# EasyEDA Pro project Amplifier_6Channels _2024-06-29.epro

# Schematic 运放
Create Date: 2024-05-17; Page Name: P1; Project Name: 十九届折线电磁; Schematic Name: 运放; Update Date: 2024-05-27; Company: 嘉立创EDA; Page Size: A4; Version: V1.0
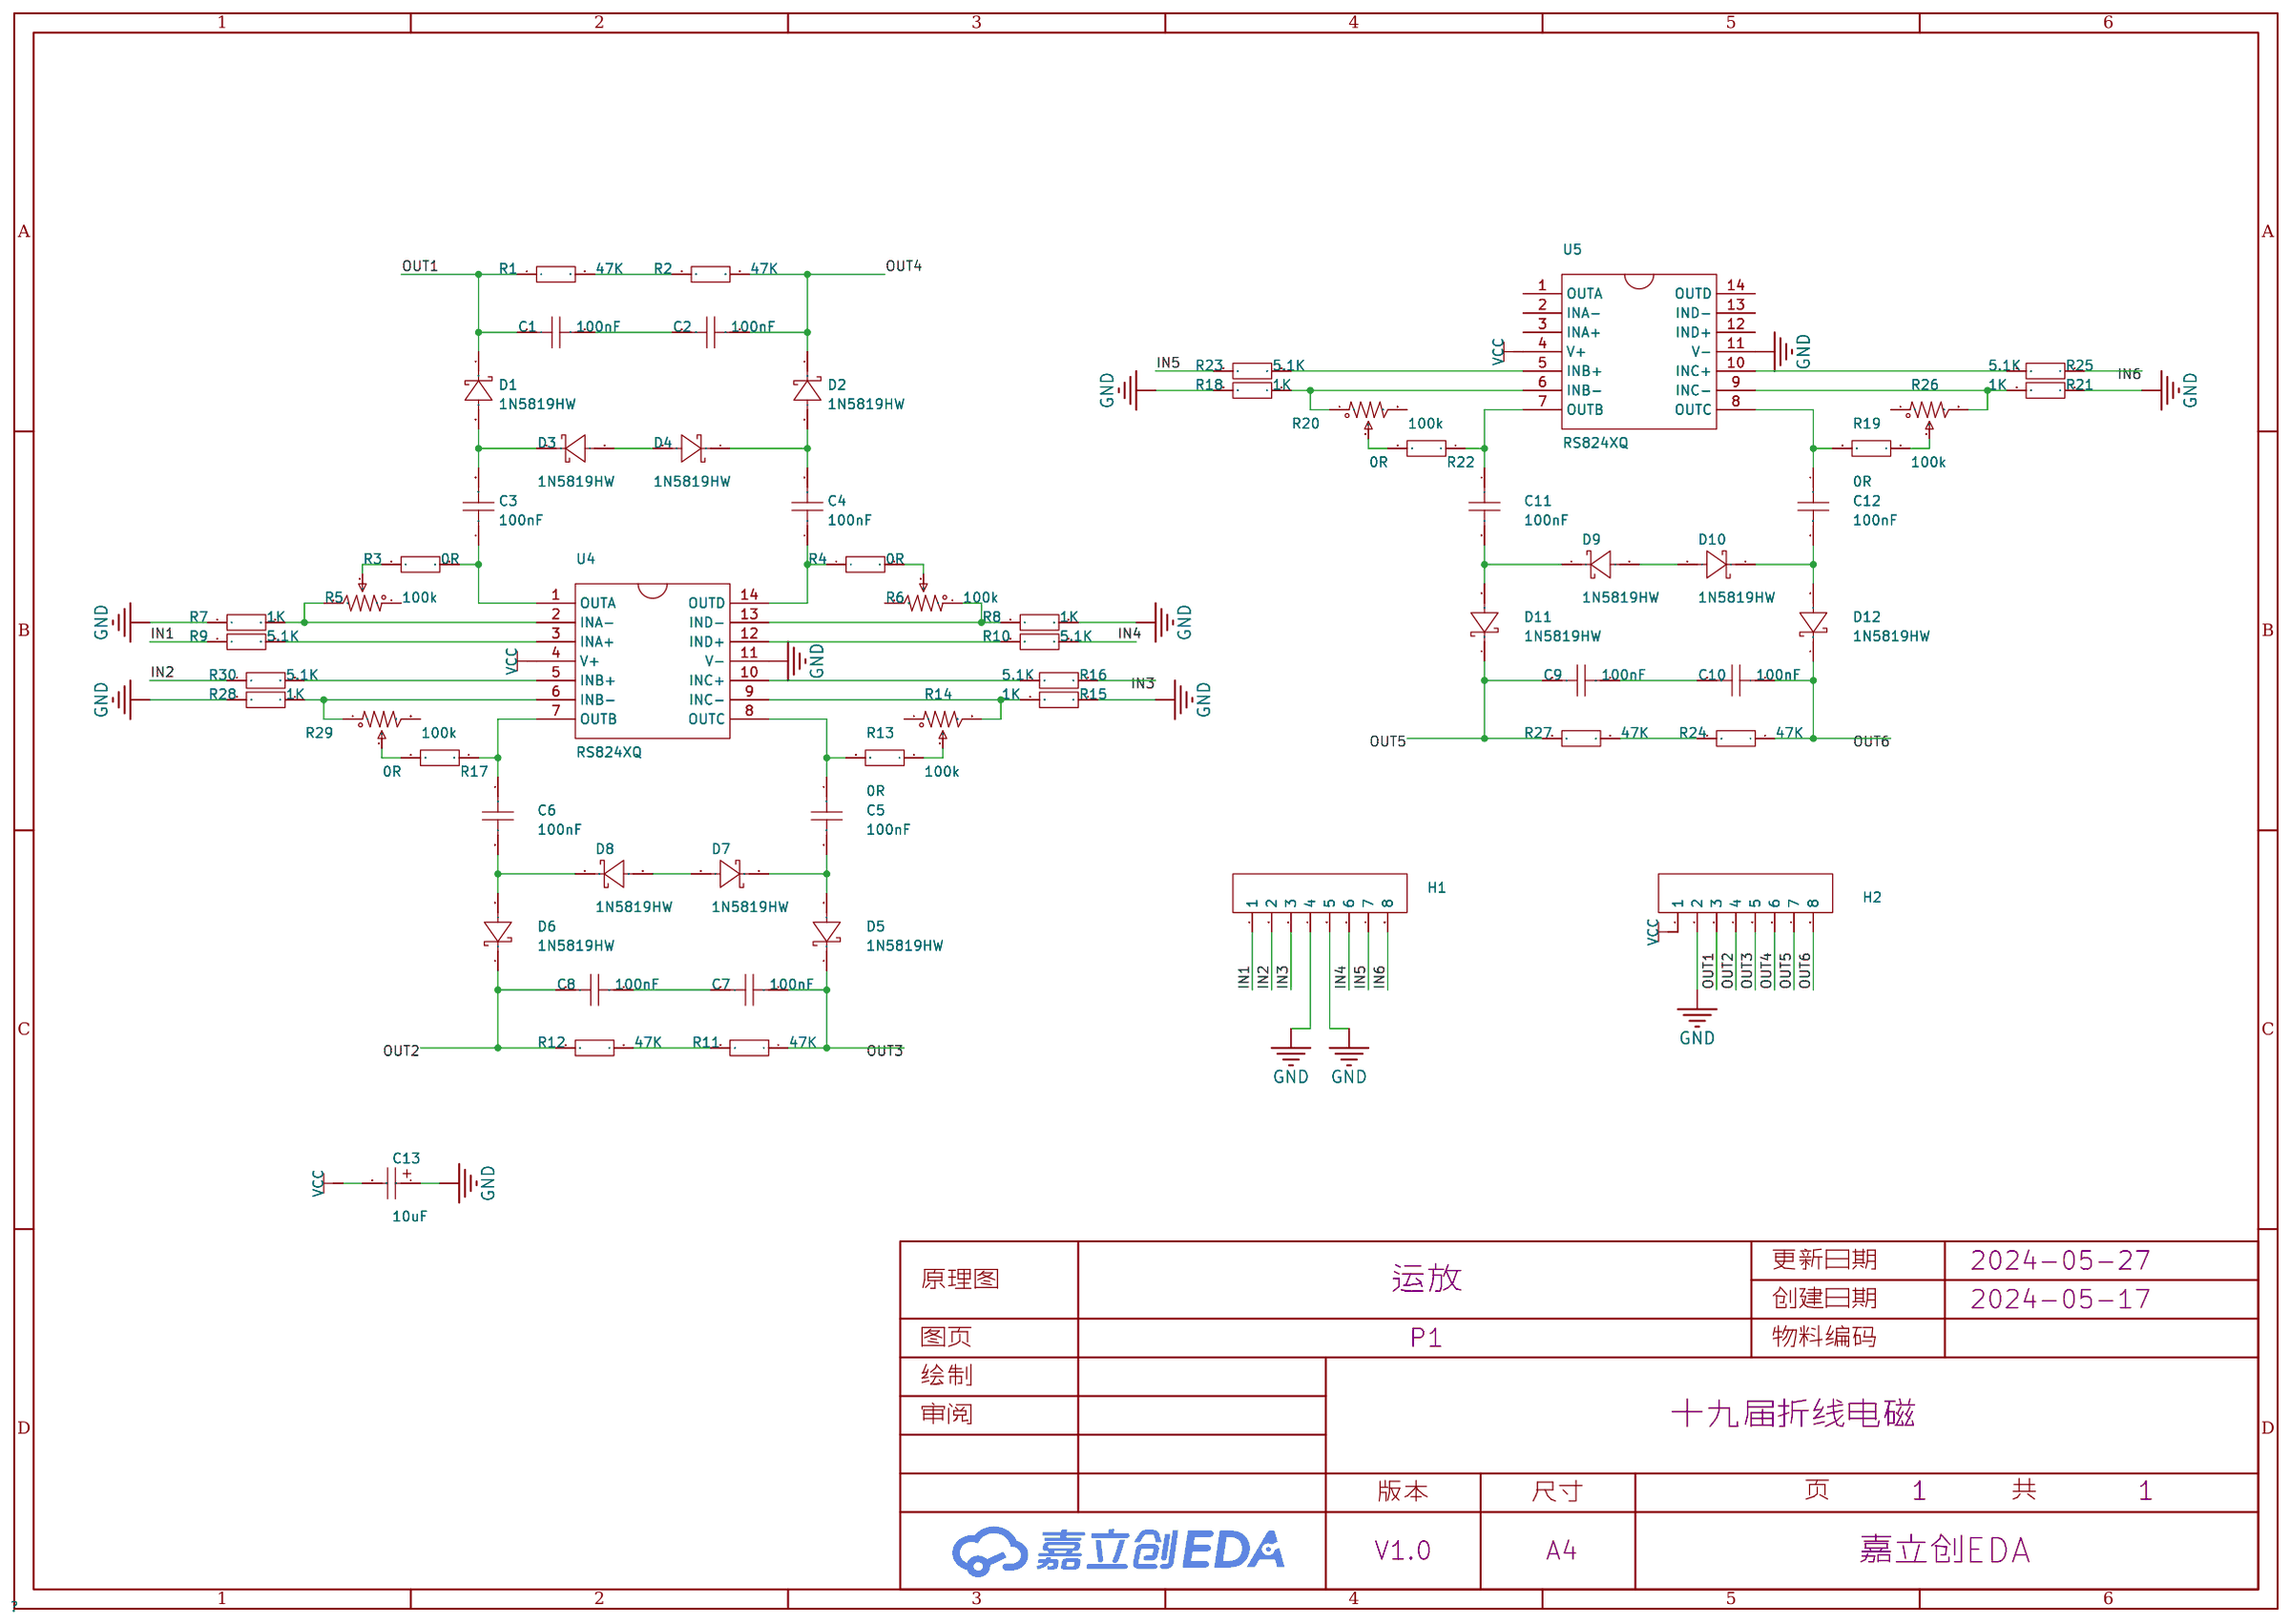
[diagram p0: schematic sheet]

## Parts
C1  100nF  [C0603]
C2  100nF  [C0603]
C3  100nF  [C0603]
C4  100nF  [C0603]
C5  100nF  [C0603]
C6  100nF  [C0603]
C7  100nF  [C0603]
C8  100nF  [C0603]
C9  100nF  [C0603]
C10  100nF  [C0603]
C11  100nF  [C0603]
C12  100nF  [C0603]
C13  10uF  [CAP-SMD_L3.2-W1.6-RD-C7171]
D1  1N5819HW  [SOD-123_L2.7-W1.6-LS3.7-RD-1]
D2  1N5819HW  [SOD-123_L2.7-W1.6-LS3.7-RD-1]
D3  1N5819HW  [SOD-123_L2.7-W1.6-LS3.7-RD-1]
D4  1N5819HW  [SOD-123_L2.7-W1.6-LS3.7-RD-1]
D5  1N5819HW  [SOD-123_L2.7-W1.6-LS3.7-RD-1]
D6  1N5819HW  [SOD-123_L2.7-W1.6-LS3.7-RD-1]
D7  1N5819HW  [SOD-123_L2.7-W1.6-LS3.7-RD-1]
D8  1N5819HW  [SOD-123_L2.7-W1.6-LS3.7-RD-1]
D9  1N5819HW  [SOD-123_L2.7-W1.6-LS3.7-RD-1]
D10  1N5819HW  [SOD-123_L2.7-W1.6-LS3.7-RD-1]
D11  1N5819HW  [SOD-123_L2.7-W1.6-LS3.7-RD-1]
D12  1N5819HW  [SOD-123_L2.7-W1.6-LS3.7-RD-1]
H1  -  [HDR-TH_8P-P2.54-V-F-1]
H2  -  [HDR-TH_8P-P2.54-V-F-1]
R1  47K  [R0603]
R2  47K  [R0603]
R3  0R  [R0603]
R4  0R  [R0603]
R5  100k  [RES-ADJ-TH_3P-L9.5-W4.85-P2.50-BL-BS]
R6  100k  [RES-ADJ-TH_3P-L9.5-W4.85-P2.50-BL-BS]
R7  1K  [R0603]
R8  1K  [R0603]
R9  5.1K  [R0603]
R10  5.1K  [R0603]
R11  47K  [R0603]
R12  47K  [R0603]
R13  0R  [R0603]
R14  100k  [RES-ADJ-TH_3P-L9.5-W4.85-P2.50-BL-BS]
R15  1K  [R0603]
R16  5.1K  [R0603]
R17  0R  [R0603]
R18  1K  [R0603]
R19  0R  [R0603]
R20  100k  [RES-ADJ-TH_3P-L9.5-W4.85-P2.50-BL-BS]
R21  1K  [R0603]
R22  0R  [R0603]
R23  5.1K  [R0603]
R24  47K  [R0603]
R25  5.1K  [R0603]
R26  100k  [RES-ADJ-TH_3P-L9.5-W4.85-P2.50-BL-BS]
R27  47K  [R0603]
R28  1K  [R0603]
R29  100k  [RES-ADJ-TH_3P-L9.5-W4.85-P2.50-BL-BS]
R30  5.1K  [R0603]
U4  RS824XQ  [TSSOP-14]
U5  RS824XQ  [TSSOP-14]

## Library data of the parts
C1-C12 = CAP_0603: Supplier Footprint: 0603
C13 = TAJA106K016RNJ: 容值:10uF;精度:±10%;额定电压:16V;等效串联电阻:3Ω@100kHz;; LCSC Part Name: 10uF ±10% 16V; Supplier Part: C7171; Manufacturer: Kyocera AVX; Supplier Footprint: CASE-A-3216; JLCPCB Part Class: 基础库; Datasheet: https://atta.szlcsc.com/upload/public/pdf/source/20160107/1457707750344.pdf; Supplier: LCSC; Tolerance: ±10%; Rated Voltage: 16V; Equivalent Series Resistance(ESR): 3Ω@100kHz; Operating Temperature: -55℃~+125℃
D1-D12 = 1N5819HW: 二极管配置:-;正向压降(Vf):900mV@3A;直流反向耐压(Vr):40V;平均整流电流(Io):1A;; LCSC Part Name: 电压:40V 电流:1A; Supplier Part: C2905649; Manufacturer: TECH PUBLIC(台舟); Supplier Footprint: SOD-123; JLCPCB Part Class: 扩展库; Datasheet: https://atta.szlcsc.com/upload/public/pdf/source/20211020/8C6B6169F42B21129AF0D528B0E96B00.pdf; Supplier: LCSC; Forward Voltage (Vf@If): 900mV@3A; Reverse Voltage (Vr): 40V; Average Rectified Current (Io): 1A; Reverse Leakage Current (Ir): 1mA@40V
H1 H2 = HDR-F_2.54_1x8P: Supplier Part: C27438; Supplier Footprint: 插件
R1-R4 R7-R13 R15-R19 R21-R25 R27 R28 R30 = Res_0603: Supplier Footprint: 0603
R5 R6 R14 R20 R26 R29 = 可调电阻: 阻值:50kΩ;精度:±10%;; LCSC Part Name: 50kΩ ±10%; Supplier Part: C118911; Manufacturer: BOCHEN(博晨); Manufacturer Part: 3296W-1-503; Supplier Footprint: 插件; JLCPCB Part Class: 扩展库; Datasheet: https://atta.szlcsc.com/upload/public/pdf/source/20171114/C118911_15106326557211117401.pdf; Supplier: LCSC; Tolerance: ±10%
U4 U5 = RS824XQ

## Nets
GND: C13.1 H1.4 H1.5 H2.2 R7.1 R8.2 R15.1 R18.2 R21.1 R28.2 U4.11(V-) U5.11(V-)
VCC: C13.2 H2.1 U4.4(V+) U5.4(V+)
IN1: H1.1 R9.1
IN2: H1.2 R30.1
IN3: H1.3 R16.1
IN4: H1.6 R10.1
IN5: H1.7 R23.1
IN6: H1.8 R25.1
OUT1: C1.1 D1.1(K) H2.3 R1.1
OUT2: C8.2 D6.1(K) H2.4 R12.2
OUT3: C7.1 D5.1(K) H2.5 R11.1
OUT4: C2.2 D2.1(K) H2.6 R2.2
OUT5: C9.2 D11.1(K) H2.7 R27.2
OUT6: C10.1 D12.1(K) H2.8 R24.1
$1N672: D3.2(A) D4.2(A)
$1N675: C3.2 D1.2(A) D3.1(K)
$1N680: C4.2 D2.2(A) D4.1(K)
$1N763: C1.2 C2.1
$1N935: C3.1 R3.2 U4.1(OUTA)
$1N1156: R3.1 R5.2
$1N1168: R5.3 R7.2 U4.2(INA-)
$1N2155: C4.1 R4.1 U4.14(OUTD)
$1N2200: R4.2 R6.2
$1N2236: R10.2 U4.12(IND+)
$1N2317: R6.1 R8.1 U4.13(IND-)
$1N4845: R1.2 R2.1
$1N4873: R9.2 U4.3(INA+)
$1N5401: D7.2(A) D8.2(A)
$1N5403: C5.2 D5.2(A) D7.1(K)
$1N5407: C6.2 D6.2(A) D8.1(K)
$1N5411: C7.2 C8.1
$1N5427: C5.1 R13.2 U4.8(OUTC)
$1N5432: R13.1 R14.2
$1N5435: R14.3 R15.2 U4.9(INC-)
$1N5448: C6.1 R17.1 U4.7(OUTB)
$1N5453: R17.2 R29.2
$1N5456: R30.2 U4.5(INB+)
$1N5458: R28.1 R29.1 U4.6(INB-)
$1N5465: R11.2 R12.1
$1N5467: R16.2 U4.10(INC+)
$1N6701: R25.2 U5.10(INC+)
$1N6702: R24.2 R27.1
$1N6704: R18.1 R20.1 U5.6(INB-)
$1N6705: R23.2 U5.5(INB+)
$1N6706: R20.2 R22.2
$1N6707: C11.1 R22.1 U5.7(OUTB)
$1N6713: R21.2 R26.3 U5.9(INC-)
$1N6714: R19.1 R26.2
$1N6715: C12.1 R19.2 U5.8(OUTC)
$1N6720: C9.1 C10.2
$1N6721: C11.2 D9.1(K) D11.2(A)
$1N6722: C12.2 D10.1(K) D12.2(A)
$1N6723: D9.2(A) D10.2(A)

Not connected (* = marked no-connect by the designer): R5 1; R6 3; R14 1; R20 3; R26 1; R29 3; U5 1(OUTA) 2(INA-) 3(INA+) 12(IND+) 13(IND-) 14(OUTD)

# Board PCB4
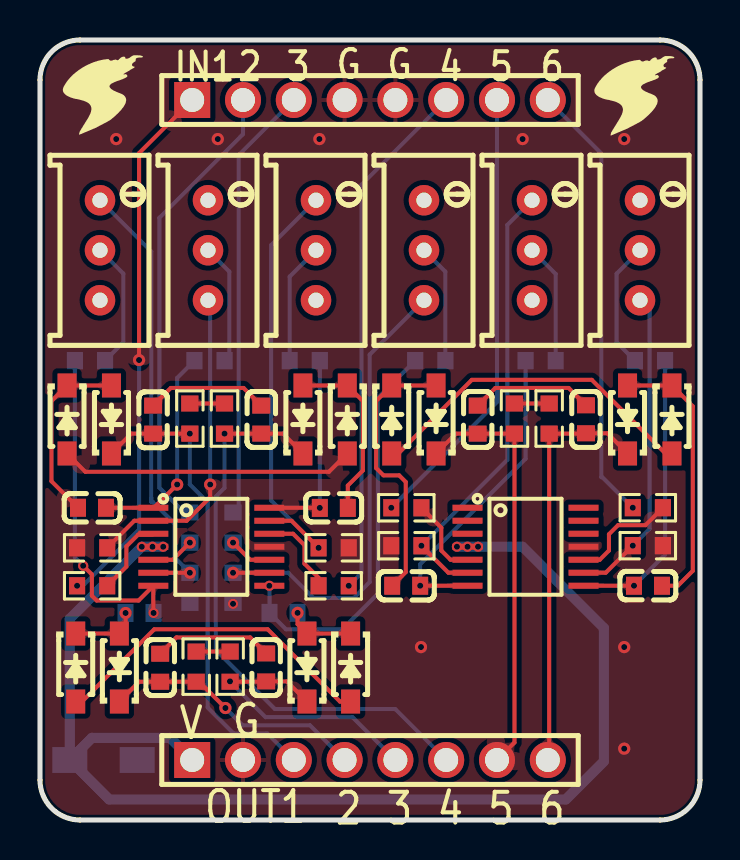
[diagram p1: board, top side]
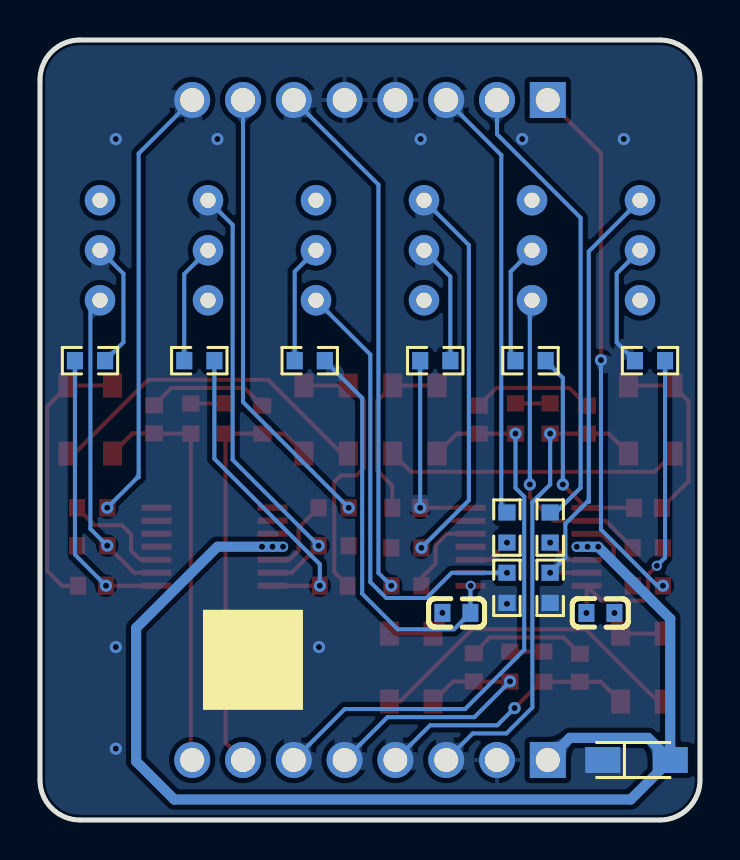
[diagram p2: board, bottom side, seen from below]

Outline 33 x 39 mm; copper layers: Top Layer, Bottom Layer. Coordinates in mm from the lower left corner of the outline.
Outline path: 0,37 0,2 arc(0.59,0.59) 2,0 31,0 arc(32.41,0.59) 33,2 33,37 arc(32.41,38.41) 31,39 2,39 arc(0.59,38.41) 0,37
Stack: Top Layer 0.035mm / Dielectric1 1.51mm FR4 er 4.5 / Bottom Layer 0.035mm

## Design rules (mm)
template: 自定义配置
spacing copperThickness1oz (default): track to track 0.203, other pairs 0.203 to 0.203
spacing copperThickness2oz: track to track 0.203, other pairs 0.152 to 0.3
track width copperThickness1oz (default): min 0.203, default 0.203, max 2.54
track width copperThickness2oz: min 0.203, default 0.254, max 2.54
track width VCC: min 0.508, default 0.508, max 2.54
differential pair differentialPair (default): width min 0.127, default 0.254, max 2.54; gap min 0.152, default 0.152
via viaSize (default): diameter min 0.5, default 0.61, max 10; hole min 0.3, default 0.305, max 6.299
net VCC uses VCC

## Placement (name value [footprint] x y rotation side)
C1  100nF  [C0603]  5.66 20.02 90 top
C2  100nF  [C0603]  11.06 20.02 270 top
C3  100nF  [C0603]  2.6 15.61 180 top
C4  100nF  [C0603]  14.69 15.61 0 top
C5  100nF  [C0603]  12.18 10.36 0 bottom
C6  100nF  [C0603]  4.98 10.35 180 bottom
C7  100nF  [C0603]  11.31 7.63 90 top
C8  100nF  [C0603]  6.01 7.61 270 top
C9  100nF  [C0603]  21.88 20.02 270 top
C10  100nF  [C0603]  27.3 20.03 90 top
C11  100nF  [C0603]  18.31 11.71 180 top
C12  100nF  [C0603]  30.4 11.71 0 top
C13  10uF  [CAP-SMD_L3.2-W1.6-RD-C7171]  3.18 3 180 bottom
D1  1N5819HW  [SOD-123_L2.7-W1.6-LS3.7-RD-1]  3.57 20.03 90 top
D2  1N5819HW  [SOD-123_L2.7-W1.6-LS3.7-RD-1]  13.14 20.03 90 top
D3  1N5819HW  [SOD-123_L2.7-W1.6-LS3.7-RD-1]  1.35 20.03 270 top
D4  1N5819HW  [SOD-123_L2.7-W1.6-LS3.7-RD-1]  15.37 20.03 270 top
D5  1N5819HW  [SOD-123_L2.7-W1.6-LS3.7-RD-1]  13.35 7.62 90 top
D6  1N5819HW  [SOD-123_L2.7-W1.6-LS3.7-RD-1]  3.97 7.62 90 top
D7  1N5819HW  [SOD-123_L2.7-W1.6-LS3.7-RD-1]  15.53 7.62 270 top
D8  1N5819HW  [SOD-123_L2.7-W1.6-LS3.7-RD-1]  1.79 7.62 270 top
D9  1N5819HW  [SOD-123_L2.7-W1.6-LS3.7-RD-1]  17.59 20.03 270 top
D10  1N5819HW  [SOD-123_L2.7-W1.6-LS3.7-RD-1]  31.6 20.03 270 top
D11  1N5819HW  [SOD-123_L2.7-W1.6-LS3.7-RD-1]  19.81 20.03 90 top
D12  1N5819HW  [SOD-123_L2.7-W1.6-LS3.7-RD-1]  29.38 20.03 90 top
H1  -  [HDR-TH_8P-P2.54-V-F-1]  16.5 36 0 top
H2  -  [HDR-TH_8P-P2.54-V-F-1]  16.5 3 0 top
R1  47K  [R0603]  7.49 20.07 90 top
R2  47K  [R0603]  9.23 20.07 270 top
R3  0R  [R0603]  8.47 22.97 180 bottom
R4  0R  [R0603]  13.24 22.97 180 bottom
R5  100k  [RES-ADJ-TH_3P-L9.5-W4.85-P2.50-BL-BS]  8.4 28.49 0 top
R6  100k  [RES-ADJ-TH_3P-L9.5-W4.85-P2.50-BL-BS]  13.8 28.49 0 top
R7  1K  [R0603]  2.61 13.61 0 top
R8  1K  [R0603]  14.68 13.61 0 top
R9  5.1K  [R0603]  2.61 11.71 0 top
R10  5.1K  [R0603]  14.68 11.71 180 top
R11  47K  [R0603]  9.51 7.67 90 top
R12  47K  [R0603]  7.81 7.67 270 top
R13  0R  [R0603]  19.51 22.97 180 bottom
R14  100k  [RES-ADJ-TH_3P-L9.5-W4.85-P2.50-BL-BS]  19.2 28.49 0 top
R15  1K  [R0603]  9.65 11.61 90 bottom
R16  5.1K  [R0603]  9.65 14.62 270 bottom
R17  0R  [R0603]  2.5 22.97 0 bottom
R18  1K  [R0603]  18.32 13.71 180 top
R19  0R  [R0603]  30.5 22.97 0 bottom
R20  100k  [RES-ADJ-TH_3P-L9.5-W4.85-P2.50-BL-BS]  24.6 28.49 0 top
R21  1K  [R0603]  30.39 13.72 180 top
R22  0R  [R0603]  25.03 22.97 0 bottom
R23  5.1K  [R0603]  18.32 15.61 0 top
R24  47K  [R0603]  25.46 20.07 90 top
R25  5.1K  [R0603]  30.39 15.61 0 top
R26  100k  [RES-ADJ-TH_3P-L9.5-W4.85-P2.50-BL-BS]  30 28.49 0 top
R27  47K  [R0603]  23.72 20.07 270 top
R28  1K  [R0603]  7.49 11.61 270 bottom
R29  100k  [RES-ADJ-TH_3P-L9.5-W4.85-P2.50-BL-BS]  3 28.49 0 top
R30  5.1K  [R0603]  7.49 14.62 270 bottom
U4  RS824XQ  [TSSOP-14]  8.57 13.66 0 top
U5  RS824XQ  [TSSOP-14]  24.28 13.66 0 top
U6  -  [JLC-QRCODE-5x5]  22.35 8.01 180 bottom

## Footprints (pads in the part's own frame, mm; a bottom-side part is the same pattern mirrored in y, then rotated)
C0603
  rect 0.8x0.9 smd: 1(-0.7,0) 2(0.7,0)
CAP-SMD_L3.2-W1.6-RD-C7171
  rect 1.758x1.296 smd: 1(-1.687,0) 2(1.687,0)
HDR-TH_8P-P2.54-V-F-1
  rect 1.8x1.8 hole 1.2: 1(-8.89,0)
  round 1.8 hole 1.2: 2(-6.35,0) 3(-3.81,0) 4(-1.27,0) 5(1.27,0) 6(3.81,0) 7(6.35,0) 8(8.89,0)
R0603
  rect 0.806x0.864 smd: 1(-0.753,0) 2(0.753,0)
RES-ADJ-TH_3P-L9.5-W4.85-P2.50-BL-BS
  round 1.524 hole 0.762: 1(0,2.5) 2(0,0) 3(0,-2.5)
SOD-123_L2.7-W1.6-LS3.7-RD-1
  rect 1.2x0.95 smd: 1(-1.7,0) 2(1.7,0)
TSSOP-14
  rect 1.5x0.3 smd: 1(-2.9,1.95) 2(-2.9,1.3) 3(-2.9,0.65) 4(-2.9,0) 5(-2.9,-0.65) 6(-2.9,-1.3) 7(-2.9,-1.95) 8(2.9,-1.95) 9(2.9,-1.3) 10(2.9,-0.65) 11(2.9,0) 12(2.9,0.65) 13(2.9,1.3) 14(2.9,1.95)

## Nets
As in the schematic.

Pads without a net: R5 1; R6 3; R14 1; R20 3; R26 1; R29 3; U5 1 2 3 12 13 14

## Via types
v1: diameter 0.61, hole 0.305, Top Layer to Bottom Layer, 23 vias
v2: diameter 0.61, hole 0.304, Top Layer to Bottom Layer, 8 vias
v3: diameter 0.508, hole 0.305, Top Layer to Bottom Layer, 10 vias

## Routing (per net, layer and track width the routed paths; a pad name or vN(x,y) marks a point on that pad's centre or on a via; arc(x,y) is an arc through that point)
GND:
  vias: v2(3.81,34.05) v2(8.89,34.05) v2(13.97,34.05) v2(19.05,8.65) v2(24.13,34.05) v2(29.21,34.05) v2(29.21,8.65) v2(29.21,3.57) v3(9.65,10.81)
VCC: length 64.2
  Bottom Layer w0.508: C13.2 1.49,10.06 v3(5.09,13.66) v3(5.62,13.66) v3(6.16,13.66) ; C13.2 3.46,1.03 26.29,1.03 28.19,2.93 28.19,9.6 24.13,13.66 ; C13.2 2.59,4.11 6.5,4.11 H2.1 ; 24.07,13.66 v3(21.9,13.66) v3(21.38,13.66) v3(20.85,13.66)
IN1: length 26.8
  Top Layer w0.203: H1.1 4.95,33.34 v1(4.95,23)
  Bottom Layer w0.203: v1(4.95,23) 4.95,14.52 2.14,11.71 v1(1.85,11.71)
IN2: length 23.2
  Bottom Layer w0.203: H1.2 10.15,34.29 5.97,30.11 5.97,16.61 7.21,15.38 R30.1
IN3: length 21.9
  Bottom Layer w0.203: H1.3 9.94,33.25 9.94,15.66 R16.1
IN4: length 26.3
  Bottom Layer w0.203: H1.6 16.08,31.77 16.08,12.35 v1(15.44,11.71)
IN5: length 22.6
  Bottom Layer w0.203: H1.7 22.85,20.9 v1(17.56,15.61)
IN6: length 22.2
  Bottom Layer w0.203: H1.8 28.07,33.32 28.07,17.14 28.11,17.14 v1(29.64,15.61)
OUT1: length 23.8
  Top Layer w0.203: D1.1 4.56,19.32 C1.1 v1(7.49,19.32)
  Bottom Layer w0.203: H2.3 11.36,4.33 9.68,4.33 8.38,5.63 8.38,15.89 7.49,16.78 v1(7.49,19.32)
OUT2: length 13.3
  Top Layer w0.203: D6.1 4.96,6.91 C8.2 R12.2 7.96,6.91 v1(9.27,5.6)
  Bottom Layer w0.203: H2.4 13.49,4.74 10.13,4.74 v1(9.27,5.6)
OUT3: length 14.2
  Top Layer w0.203: D5.1 12.34,6.93 C7.1 11.29,6.91 R11.1
  Bottom Layer w0.203: R11.1 11.28,5.14 15.63,5.14 H2.5
  vias: v1(9.5,6.93)
OUT4: length 29.1
  Top Layer w0.203: D2.1 12.15,19.32 C2.2 v1(9.23,19.32)
  Bottom Layer w0.203: H2.6 17.76,5.55 11.75,5.55 8.79,8.51 8.79,16.17 9.23,16.6 v1(9.23,19.32)
OUT5: length 21
  Top Layer w0.203: H2.7 23.72,3.87 23.72,19.32 C9.2 20.8,19.32 D11.1
OUT6: length 20.7
  Top Layer w0.203: D12.1 28.37,19.33 C10.1 27.28,19.32 25.46,19.32 25.46,3.07 H2.8
$1N672: length 14.8
  Top Layer w0.203: D4.2 14.45,17.41 2.27,17.41 D3.2
$1N675: length 9.2
  Top Layer w0.203: C3.2 0.57,16.94 0.57,20.95 D3.1 D1.2
$1N680: length 9
  Top Layer w0.203: D2.2 D4.1 16.14,20.95 16.14,17.48 15.39,16.72 C4.2
$1N763: length 6.1
  Top Layer w0.203: C1.2 6.54,21.6 10.18,21.6 C2.1
$1N935: length 10.6
  Top Layer w0.203: C3.1 U4.1 5.69,15.61 v1(6.86,16.78)
  Bottom Layer w0.203: v1(6.86,16.78) 6.86,22.1 R3.2
$1N1156: length 6.1
  Bottom Layer w0.203: R3.1 9.47,23.21 9.47,27.42 R5.2
$1N1168: length 16.1
  Top Layer w0.203: 3.36,13.61 4.71,14.96 U4.2 7.33,14.96 8.51,16.14 v1(8.51,16.78)
  Bottom Layer w0.203: R5.3 8.51,25.88 v1(8.51,16.78)
$1N2155: length 9.9
  Top Layer w0.203: U4.14 13.99,15.61 v1(13.99,15.61)
  Bottom Layer w0.203: v1(13.99,15.61) R4.1
$1N2200: length 6.1
  Bottom Layer w0.203: R4.2 12.48,27.17 R6.2
$1N2236: length 4.3
  Top Layer w0.203: U4.12 12.65,14.31 13.22,13.74 13.22,12.82 13.93,12.11 R10.2
$1N2317: length 22.3
  Top Layer w0.203: U4.13 12.58,14.96 v1(13.93,13.61)
  Bottom Layer w0.203: v1(13.93,13.61) 11.56,15.98 11.56,28.74 R6.1
$1N4845: length 1.7
  Top Layer w0.203: R2.1 R1.2
$1N4873: length 4
  Top Layer w0.203: R9.2 4.32,12.67 4.32,13.68 4.92,14.28 5.67,14.28
$1N5401: length 16.7
  Top Layer w0.203: D7.2 15,5.92 11.38,9.53 5.71,9.53 2.1,5.92 D8.2
$1N5403: length 3.4
  Top Layer w0.203: D7.1 D5.2 12.88,9.79 v1(12.88,10.36)
$1N5407: length 3.3
  Top Layer w0.203: D8.1 D6.2 4.28,9.63 v1(4.28,10.35)
$1N5411: length 6
  Top Layer w0.203: C8.1 6.82,9.13 10.51,9.13 C7.2
$1N5427: length 20.3
  Bottom Layer w0.203: v3(11.47,11.71) 11.48,11.7 C5.1 12.3,9.54 15.11,9.54 16.89,11.31 16.89,21.1 R13.2
$1N5432: length 6
  Bottom Layer w0.203: 20.27,22.97 20.27,27.42 R14.2
$1N5435: length 24.7
  Top Layer w0.203: v1(9.65,12.36) U4.9
  Bottom Layer w0.203: v1(9.65,12.36) 12.41,12.36 13.67,11.1 15.69,11.1 16.48,11.9 16.48,23.27 R14.3
$1N5448: length 16.9
  Top Layer w0.203: v3(2.16,12.71) 2.59,12.28 2.59,11.21 2.83,10.97 4.93,10.97 U4.7 5.67,10.42
  Bottom Layer w0.203: v3(2.16,12.71) 1.75,13.12 R17.1
  vias: v3(5.68,10.35)
$1N5453: length 6.4
  Bottom Layer w0.203: R29.2 4.17,27.32 4.17,23.88 R17.2
$1N5456: length 2.2
  Top Layer w0.203: U4.5 6.64,13.01 v1(7.49,13.87)
$1N5458: length 22.5
  Top Layer w0.203: U4.6 v1(7.49,12.36)
  Bottom Layer w0.203: R29.1 5.56,28.42 5.56,15.91 ; 5.56,15.91 5.63,15.91 6.73,14.81 6.73,13.12 v1(7.49,12.36) ; 5.56,15.91 5.56,16.11
$1N5465: length 1.7
  Top Layer w0.203: R12.1 R11.2
$1N5467: length 2.2
  Top Layer w0.203: U4.10 10.51,13.01 v1(9.65,13.87)
$1N6701: length 5.5
  Top Layer w0.203: R25.2 30.27,14.74 28.9,14.74 28.45,14.29 28.45,13.47 27.99,13.01 U5.10
$1N6702: length 1.7
  Top Layer w0.203: R27.1 R24.2
$1N6704: length 22.4
  Top Layer w0.203: v1(19.07,13.71) 20.42,12.36 U5.6
  Bottom Layer w0.203: v1(19.07,13.71) 23.37,18.01 23.37,29.75 R20.1
$1N6705: length 4.1
  Top Layer w0.203: R23.2 20.07,14.62 20.07,13.47 20.53,13.01 U5.5
$1N6706: length 6
  Bottom Layer w0.203: R20.2 25.79,27.3 R22.2
$1N6707: length 15.8
  Top Layer w0.203: v1(19.01,11.71) U5.7
  Bottom Layer w0.203: v1(19.01,11.71) 19.01,12.79 24.28,18.06 R22.1
$1N6713: length 15.8
  Top Layer w0.203: v1(29.64,13.72) 28.29,12.36 U5.9
  Bottom Layer w0.203: R26.3 30.48,25.51 30.48,14.56 v1(29.64,13.72)
$1N6714: length 6.4
  Bottom Layer w0.203: R19.1 28.83,23.89 28.83,27.32 R26.2
$1N6715: length 14.4
  Top Layer w0.203: U5.8 v1(29.7,11.71)
  Bottom Layer w0.203: v1(29.7,11.71) 31.25,13.27 R19.2
$1N6720: length 6.1
  Top Layer w0.203: C10.2 26.43,21.6 22.77,21.6 C9.1
$1N6721: length 13.9
  Top Layer w0.203: C11.2 18.29,12.39 18.29,16.9 17.96,17.23 17.17,17.23 16.81,17.6 16.81,20.95 D9.1 D11.2
$1N6722: length 13.8
  Top Layer w0.203: C12.2 31.9,11.71 32.64,12.46 32.64,20.69 D10.1 D12.2
$1N6723: length 17.1
  Top Layer w0.203: D9.2 17.91,18.33 21.59,22.01 27.59,22.01 31.27,18.33 D10.2

## Copper pours and planes (outline as drawn; the poured copper is in the pictures)
GND on Top Layer: -1.27,41.03 42.42,41.03 42.42,-1.51 -1.27,-1.51
GND on Bottom Layer: -9.4,43.44 34.54,43.44 34.54,-3.29 -9.4,-3.29

Small or netless copper shapes (teardrops, artwork), in the pictures only: 110 on Top Layer, 60 on Bottom Layer

## Text on the board
Top Solder Mask Layer: 2024年 / 6月20日 | 江西科技学院 | BST-磁驭
Top Silkscreen Layer: IN1 | 2 | 3 | G | 4 | 5 | 6 | V | OUT1
